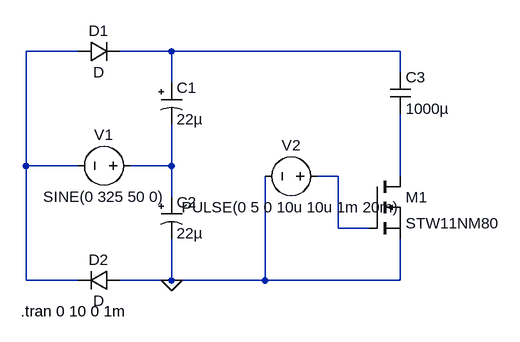
[diagram p0: schematic fullwave-doubler-1V01.asc]
fullwave-doubler-1V01.asc, the LTspice schematic file:
Version 4
SHEET 1 880 680
WIRE 96 -16 16 -16
WIRE 240 -16 160 -16
WIRE 592 -16 240 -16
WIRE 592 16 592 -16
WIRE 240 32 240 -16
WIRE 16 160 16 -16
WIRE 96 160 16 160
WIRE 240 160 240 96
WIRE 240 160 176 160
WIRE 496 176 464 176
WIRE 592 176 592 80
WIRE 240 208 240 160
WIRE 496 256 496 176
WIRE 544 256 496 256
WIRE 16 336 16 160
WIRE 96 336 16 336
WIRE 240 336 240 272
WIRE 240 336 160 336
WIRE 384 336 384 176
WIRE 384 336 240 336
WIRE 592 336 592 272
WIRE 592 336 384 336
FLAG 240 336 0
SYMBOL voltage 192 160 R90
WINDOW 0 -32 56 VBottom 2
WINDOW 3 32 56 VTop 2
WINDOW 123 0 0 Left 2
WINDOW 39 0 0 Left 2
SYMATTR InstName V1
SYMATTR Value SINE(0 325 50 0)
SYMBOL diode 96 0 R270
WINDOW 0 32 32 VTop 2
WINDOW 3 0 32 VBottom 2
SYMATTR InstName D1
SYMBOL diode 160 320 R90
WINDOW 0 0 32 VBottom 2
WINDOW 3 32 32 VTop 2
SYMATTR InstName D2
SYMBOL polcap 224 32 R0
WINDOW 3 24 56 Left 2
SYMATTR Value 22µ
SYMATTR InstName C1
SYMATTR Description Capacitor
SYMATTR Type cap
SYMATTR SpiceLine V=450 Rser=2.4 Lser=0
SYMBOL polcap 224 208 R0
WINDOW 3 24 56 Left 2
SYMATTR Value 22µ
SYMATTR InstName C2
SYMATTR Description Capacitor
SYMATTR Type cap
SYMATTR SpiceLine V=450 Irms=0 Rser=2.4 Lser=0
SYMBOL cap 576 16 R0
SYMATTR InstName C3
SYMATTR Value 1000µ
SYMATTR SpiceLine V=450 Rser=100m
SYMBOL nmos 544 176 R0
SYMATTR InstName M1
SYMATTR Value STW11NM80
SYMBOL voltage 480 176 R90
WINDOW 0 -32 56 VBottom 2
WINDOW 3 32 56 VTop 2
WINDOW 123 0 0 Left 2
WINDOW 39 0 0 Left 2
SYMATTR InstName V2
SYMATTR Value PULSE(0 5 0 10u 10u 1m 20m)
TEXT 8 384 Left 2 !.tran 0 10 0 1m

The netlist it stands for:
* fullwave-doubler-1V01.asc
V1 N003 N001 SINE(0 325 50 0)
D1 N001 N002 D
D2 0 N001 D
C1 N002 N003 22µ V=450 Rser=2.4 Lser=0
C2 N003 0 22µ V=450 Irms=0 Rser=2.4 Lser=0
C3 N002 N005 1000µ V=450 Rser=100m
M1 N005 N004 0 0 STW11NM80
V2 N004 0 PULSE(0 5 0 10u 10u 1m 20m)
.model D D
.lib standard.dio
.model NMOS NMOS
.model PMOS PMOS
.lib standard.mos
.tran 0 10 0 1m
.backanno
.end